# Altium schematic sheet Mainboard_MCU_Breakout.SchDoc
size C
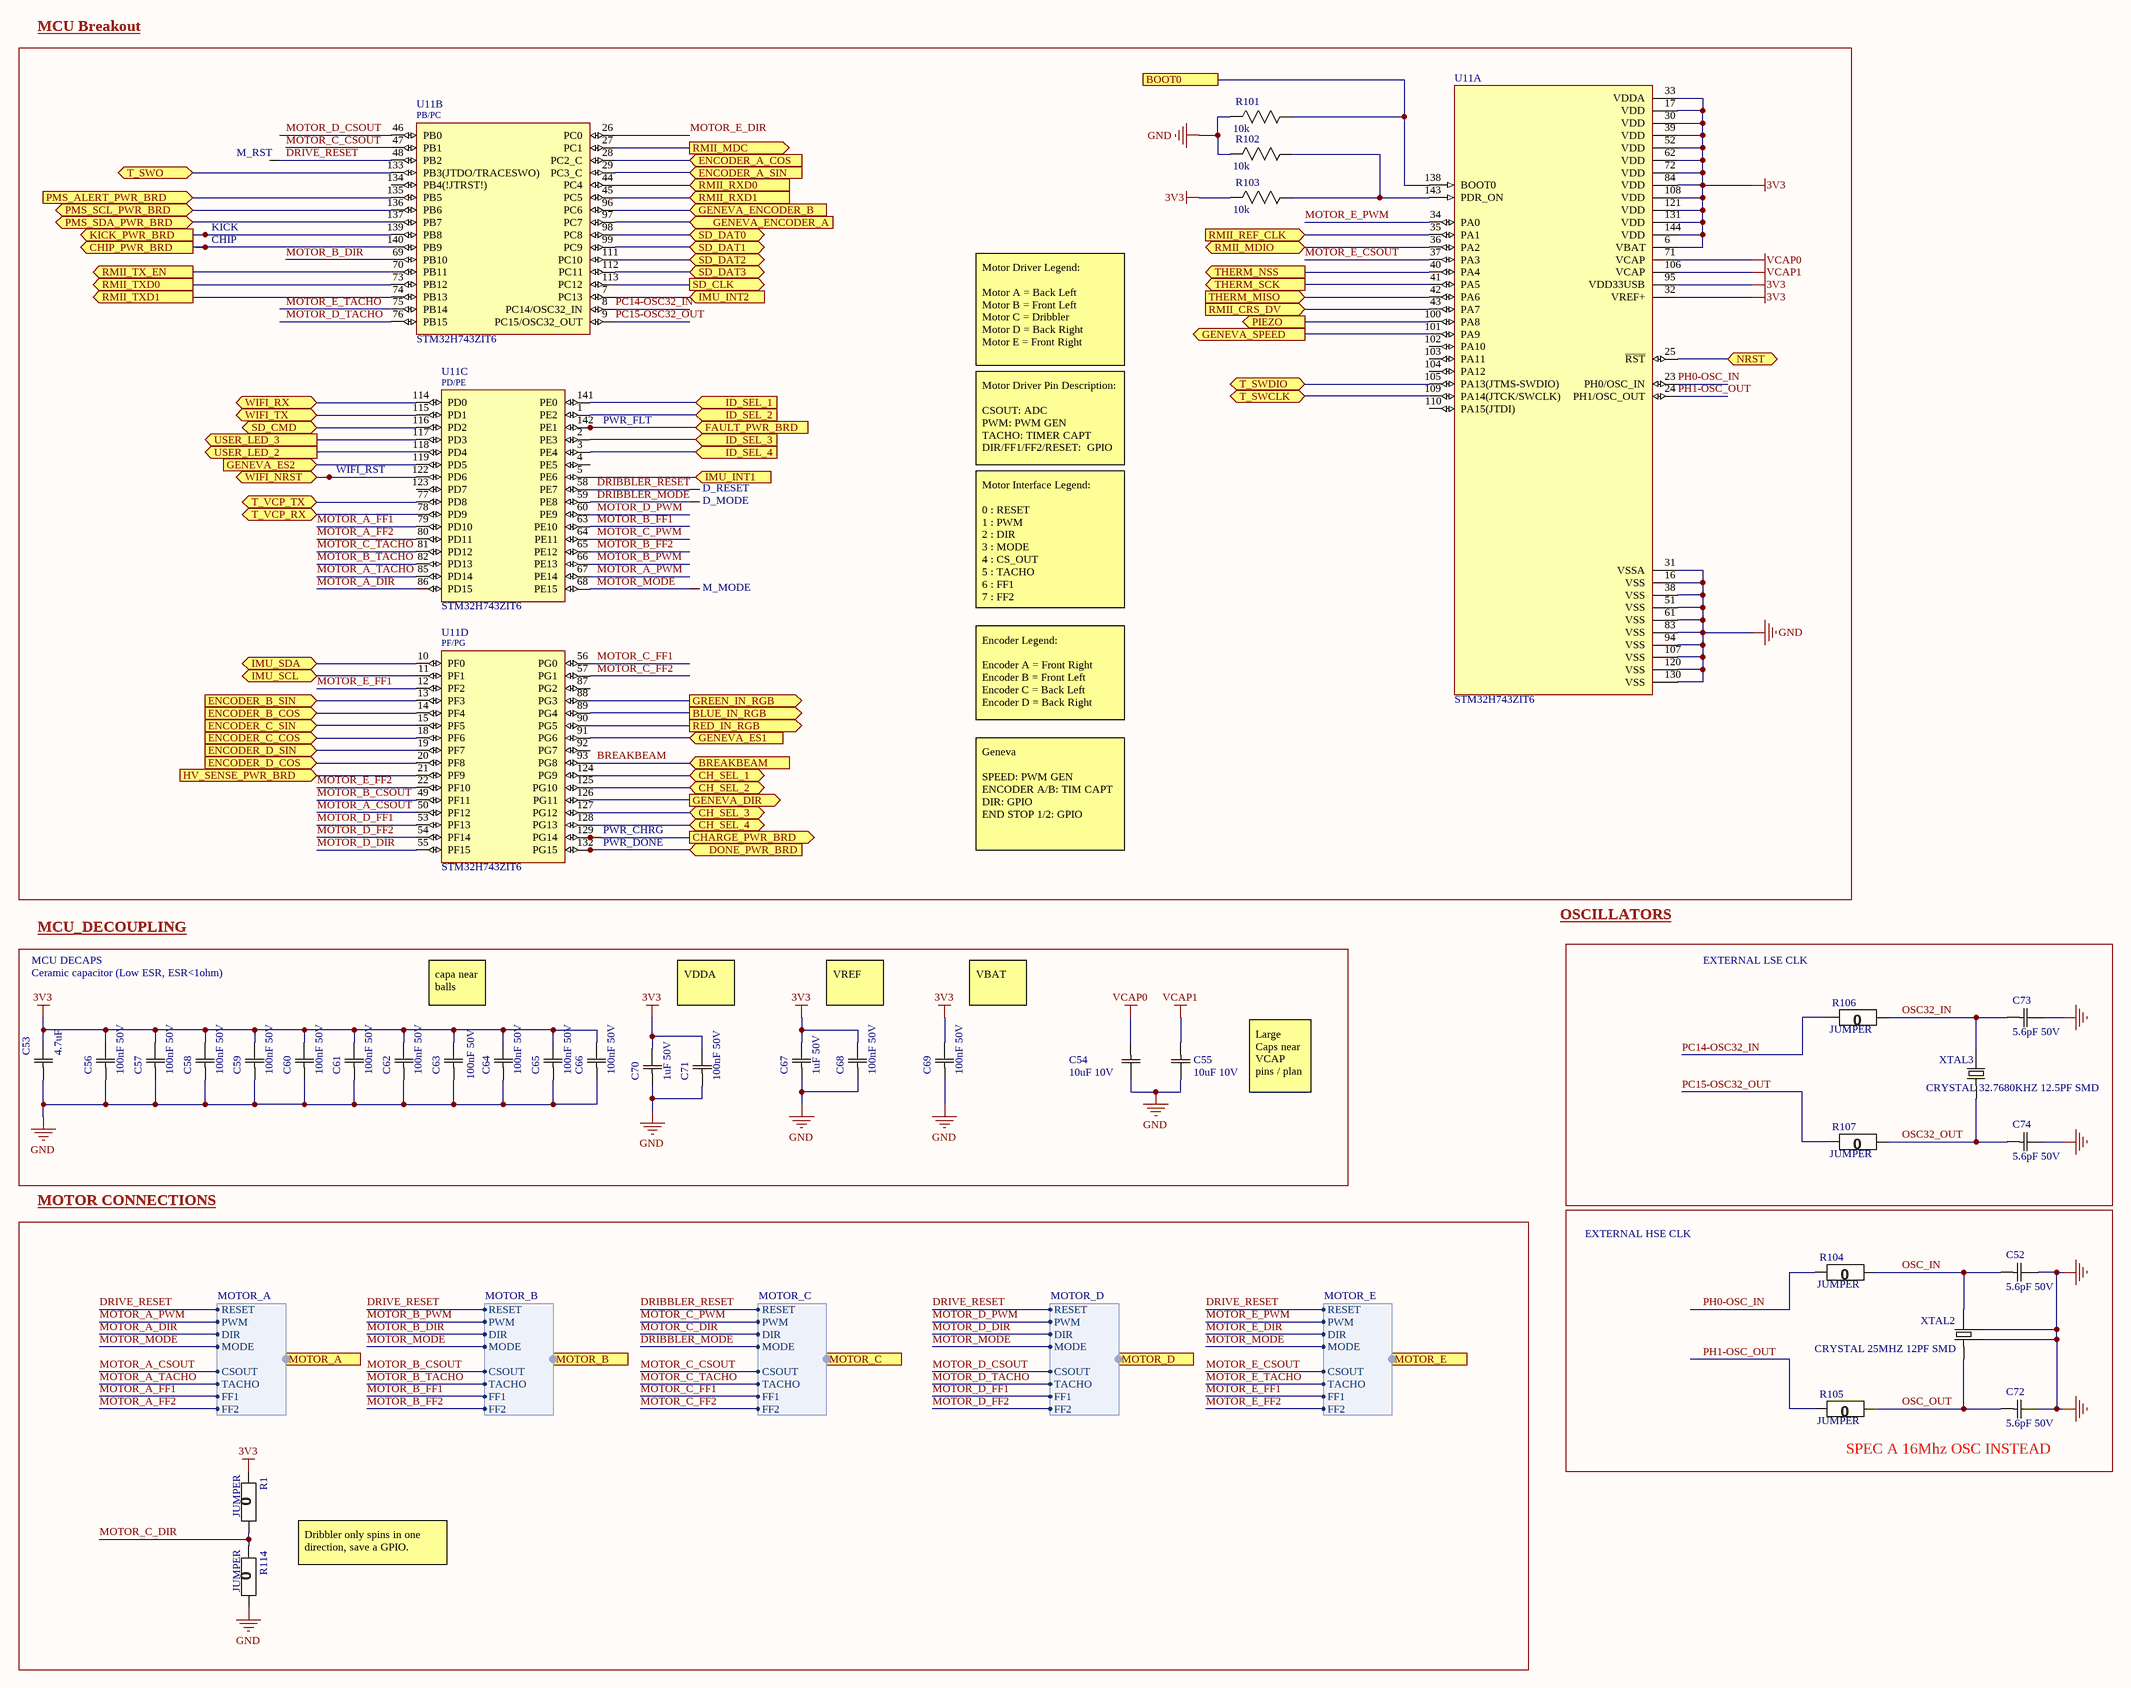
[diagram p0: Mainboard_MCU_Breakout.SchDoc]

## Parts
C52  5.6pF 50V  [0603]
C53  4.7uF  [0603]
C54  10uF 10V  [0603]
C55  10uF 10V  [0603]
C56  100nF 50V  [0603]
C57  100nF 50V  [0603]
C58  100nF 50V  [0603]
C59  100nF 50V  [0603]
C60  100nF 50V  [0603]
C61  100nF 50V  [0603]
C62  100nF 50V  [0603]
C63  100nF 50V  [0603]
C64  100nF 50V  [0603]
C65  100nF 50V  [0603]
C66  100nF 50V  [0603]
C67  1uF 50V  [0603]
C68  100nF 50V  [0603]
C69  100nF 50V  [0603]
C70  1uF 50V  [0603]
C71  100nF 50V  [0603]
C72  5.6pF 50V  [0603]
C73  5.6pF 50V  [0603]
C74  5.6pF 50V  [0603]
CHIP  Test Point (Via)  [TP]  (value not drawn)
D_MODE  Test Point (Via)  [TP]  (value not drawn)
D_RESET  Test Point (Via)  [TP]  (value not drawn)
KICK  Test Point (Via)  [TP]  (value not drawn)
M_MODE  Test Point (Via)  [TP]  (value not drawn)
M_RST  Test Point (Via)  [TP]  (value not drawn)
PWR_CHRG  Test Point (Via)  [TP]  (value not drawn)
PWR_DONE  Test Point (Via)  [TP]  (value not drawn)
PWR_FLT  Test Point (Via)  [TP]  (value not drawn)
R1  JUMPER  [0603]
R101  10k  [0603]
R102  10k  [0603]
R103  10k  [0603]
R104  JUMPER  [0603]
R105  JUMPER  [0603]
R106  JUMPER  [0603]
R107  JUMPER  [0603]
R114  JUMPER  [0603]
U11  STM32H743ZIT6  [QFP50P2200X2200X160-144N]  (parts A,B,C,D of 4)
WIFI_RST  Test Point (Via)  [TP]  (value not drawn)
XTAL2  CRYSTAL 25MHZ 12PF SMD  [3225-4SMD]
XTAL3  CRYSTAL 32.7680KHZ 12.5PF SMD  [3215 SMD2]

## Blocks framed on the sheet
MCU Breakout: CHIP D_MODE D_RESET KICK M_MODE M_RST PWR_CHRG PWR_DONE PWR_FLT R101-R103 U11 WIFI_RST
MCU_DECOUPLING: C53-C71
EXTERNAL LSE CLK: C73 C74 R106 R107 XTAL3
MOTOR CONNECTIONS: R1 R114
SPEC A 16Mhz OSC INSTEAD: C52 C72 R104 R105 XTAL2

## Ports
BLUE_IN_RGB (out), BOOT0, BREAKBEAM (in), CH_SEL_1 (bidir), CH_SEL_2 (bidir), CH_SEL_3 (bidir), CH_SEL_4 (bidir), CHARGE_PWR_BRD (out), CHIP_PWR_BRD (out), DONE_PWR_BRD (in), ENCODER_A_COS (in), ENCODER_A_SIN (in), ENCODER_B_COS (in), ENCODER_B_SIN (in), ENCODER_C_COS (in), ENCODER_C_SIN (in), ENCODER_D_COS (in), ENCODER_D_SIN (in), FAULT_PWR_BRD (in), GENEVA_DIR (out), GENEVA_ENCODER_A (in), GENEVA_ENCODER_B (in), GENEVA_ES1 (in), GENEVA_ES2 (in), GENEVA_SPEED (out), GREEN_IN_RGB (out), HV_SENSE_PWR_BRD (in), ID_SEL_1 (in), ID_SEL_2 (in), ID_SEL_3 (in), ID_SEL_4 (in), IMU_INT1 (in), IMU_INT2 (in), IMU_SCL (bidir), IMU_SDA (bidir), KICK_PWR_BRD (out), MOTOR_A (harness MOTOR_A), MOTOR_B (harness MOTOR_B), MOTOR_C (harness MOTOR_C), MOTOR_D (harness MOTOR_D), MOTOR_E (harness MOTOR_E), NRST (bidir), PIEZO (out), PMS_ALERT_PWR_BRD (in), PMS_SCL_PWR_BRD (bidir), PMS_SDA_PWR_BRD (bidir), RED_IN_RGB (out), RMII_CRS_DV (in), RMII_MDC (out), RMII_MDIO (bidir), RMII_REF_CLK (in), RMII_RXD0 (in), RMII_RXD1 (in), RMII_TX_EN (out), RMII_TXD0 (out), RMII_TXD1 (out), SD_CLK (out), SD_CMD (bidir), SD_DAT0 (bidir), SD_DAT1 (bidir), SD_DAT2 (bidir), SD_DAT3 (bidir), T_SWCLK (bidir), T_SWDIO (bidir), T_SWO (bidir), T_VCP_RX (bidir), T_VCP_TX (bidir), THERM_MISO (in), THERM_NSS (out), THERM_SCK (out), USER_LED_2 (out), USER_LED_3 (out), WIFI_NRST (bidir), WIFI_RX (bidir), WIFI_TX (bidir)

## Harnesses
MOTOR_E: DIR, MODE, TACHO, FF1, FF2, PWM, RESET, CSOUT
MOTOR_A: DIR, MODE, TACHO, FF1, FF2, PWM, RESET, CSOUT
MOTOR_B: DIR, MODE, TACHO, FF1, FF2, PWM, RESET, CSOUT
MOTOR_C: DIR, MODE, TACHO, FF1, FF2, PWM, RESET, CSOUT
MOTOR_D: DIR, MODE, TACHO, FF1, FF2, PWM, RESET, CSOUT

## Nets
3V3: C53.2(C2) C56.2(C2) C57.2(C2) C58.2(C2) C59.2(C2) C60.2(C2) C61.2(C2) C62.2(C2) C63.2(C2) C64.2(C2) C65.2(C2) C66.2(C2) C67.2(C2) C68.2(C2) C69.2(C2) C70.2(C2) C71.2(C2) R1.2(R2) R103.2(R2) U11.6(VBAT) U11.17(VDD) U11.30(VDD) U11.32(VREF+) U11.33(VDDA) U11.39(VDD) U11.52(VDD) U11.62(VDD) U11.72(VDD) U11.84(VDD) U11.95(VDD33USB) U11.108(VDD) U11.121(VDD) U11.131(VDD) U11.144(VDD)
GND: C52.2(C2) C53.1(C1) C54.2(C2) C55.2(C2) C56.1(C1) C57.1(C1) C58.1(C1) C59.1(C1) C60.1(C1) C61.1(C1) C62.1(C1) C63.1(C1) C64.1(C1) C65.1(C1) C66.1(C1) C67.1(C1) C68.1(C1) C69.1(C1) C70.1(C1) C71.1(C1) C72.2(C2) C73.2(C2) C74.2(C2) R101.2(R2) R102.2(R2) R114.1(R1) U11.16(VSS) U11.31(VSSA) U11.38(VSS) U11.51(VSS) U11.61(VSS) U11.83(VSS) U11.94(VSS) U11.107(VSS) U11.120(VSS) U11.130(VSS) XTAL2.2 XTAL2.4
VCAP0: C54.1(C1) U11.71(VCAP)
VCAP1: C55.1(C1) U11.106(VCAP)
BLUE_IN_RGB: U11.89(PG4) ; port BLUE_IN_RGB
BOOT0: R101.1(R1) U11.138(BOOT0) ; port BOOT0
BREAKBEAM: U11.93(PG8) ; port BREAKBEAM
CH_SEL_1: U11.124(PG9) ; port CH_SEL_1
CH_SEL_2: U11.125(PG10) ; port CH_SEL_2
CH_SEL_3: U11.127(PG12) ; port CH_SEL_3
CH_SEL_4: U11.128(PG13) ; port CH_SEL_4
CHARGE_PWR_BRD: PWR_CHRG.1 U11.129(PG14) ; port CHARGE_PWR_BRD
CHIP_PWR_BRD: CHIP.1 U11.140(PB9) ; port CHIP_PWR_BRD
DONE_PWR_BRD: PWR_DONE.1 U11.132(PG15) ; port DONE_PWR_BRD
DRIBBLER_MODE: D_MODE.1 U11.59(PE8) ; port MOTOR_C.MODE
DRIBBLER_RESET: D_RESET.1 U11.58(PE7) ; port MOTOR_C.RESET
DRIVE_RESET: M_RST.1 U11.48(PB2) ; port MOTOR_E.RESET, port MOTOR_A.RESET, port MOTOR_B.RESET, port MOTOR_D.RESET
ENCODER_A_COS: U11.28(PC2_C) ; port ENCODER_A_COS
ENCODER_A_SIN: U11.29(PC3_C) ; port ENCODER_A_SIN
ENCODER_B_COS: U11.14(PF4) ; port ENCODER_B_COS
ENCODER_B_SIN: U11.13(PF3) ; port ENCODER_B_SIN
ENCODER_C_COS: U11.18(PF6) ; port ENCODER_C_COS
ENCODER_C_SIN: U11.15(PF5) ; port ENCODER_C_SIN
ENCODER_D_COS: U11.20(PF8) ; port ENCODER_D_COS
ENCODER_D_SIN: U11.19(PF7) ; port ENCODER_D_SIN
FAULT_PWR_BRD: PWR_FLT.1 U11.142(PE1) ; port FAULT_PWR_BRD
GENEVA_DIR: U11.126(PG11) ; port GENEVA_DIR
GENEVA_ENCODER_A: U11.97(PC7) ; port GENEVA_ENCODER_A
GENEVA_ENCODER_B: U11.96(PC6) ; port GENEVA_ENCODER_B
GENEVA_ES1: U11.91(PG6) ; port GENEVA_ES1
GENEVA_ES2: U11.119(PD5) ; port GENEVA_ES2
GENEVA_SPEED: U11.101(PA9) ; port GENEVA_SPEED
GREEN_IN_RGB: U11.88(PG3) ; port GREEN_IN_RGB
HV_SENSE_PWR_BRD: U11.21(PF9) ; port HV_SENSE_PWR_BRD
ID_SEL_1: U11.141(PE0) ; port ID_SEL_1
ID_SEL_2: U11.1(PE2) ; port ID_SEL_2
ID_SEL_3: U11.2(PE3) ; port ID_SEL_3
ID_SEL_4: U11.3(PE4) ; port ID_SEL_4
IMU_INT1: U11.5(PE6) ; port IMU_INT1
IMU_INT2: U11.7(PC13) ; port IMU_INT2
IMU_SCL: U11.11(PF1) ; port IMU_SCL
IMU_SDA: U11.10(PF0) ; port IMU_SDA
KICK_PWR_BRD: KICK.1 U11.139(PB8) ; port KICK_PWR_BRD
MOTOR_A_CSOUT: U11.50(PF12) ; port MOTOR_A.CSOUT
MOTOR_A_DIR: U11.86(PD15) ; port MOTOR_A.DIR
MOTOR_A_FF1: U11.79(PD10) ; port MOTOR_A.FF1
MOTOR_A_FF2: U11.80(PD11) ; port MOTOR_A.FF2
MOTOR_A_PWM: U11.67(PE14) ; port MOTOR_A.PWM
MOTOR_A_TACHO: U11.85(PD14) ; port MOTOR_A.TACHO
MOTOR_B_CSOUT: U11.49(PF11) ; port MOTOR_B.CSOUT
MOTOR_B_DIR: U11.69(PB10) ; port MOTOR_B.DIR
MOTOR_B_FF1: U11.63(PE10) ; port MOTOR_B.FF1
MOTOR_B_FF2: U11.65(PE12) ; port MOTOR_B.FF2
MOTOR_B_PWM: U11.66(PE13) ; port MOTOR_B.PWM
MOTOR_B_TACHO: U11.82(PD13) ; port MOTOR_B.TACHO
MOTOR_C_CSOUT: U11.47(PB1) ; port MOTOR_C.CSOUT
MOTOR_C_DIR: R1.1(R1) R114.2(R2) ; port MOTOR_C.DIR
MOTOR_C_FF1: U11.56(PG0) ; port MOTOR_C.FF1
MOTOR_C_FF2: U11.57(PG1) ; port MOTOR_C.FF2
MOTOR_C_PWM: U11.64(PE11) ; port MOTOR_C.PWM
MOTOR_C_TACHO: U11.81(PD12) ; port MOTOR_C.TACHO
MOTOR_D_CSOUT: U11.46(PB0) ; port MOTOR_D.CSOUT
MOTOR_D_DIR: U11.55(PF15) ; port MOTOR_D.DIR
MOTOR_D_FF1: U11.53(PF13) ; port MOTOR_D.FF1
MOTOR_D_FF2: U11.54(PF14) ; port MOTOR_D.FF2
MOTOR_D_PWM: U11.60(PE9) ; port MOTOR_D.PWM
MOTOR_D_TACHO: U11.76(PB15) ; port MOTOR_D.TACHO
MOTOR_E_CSOUT: U11.37(PA3) ; port MOTOR_E.CSOUT
MOTOR_E_DIR: U11.26(PC0) ; port MOTOR_E.DIR
MOTOR_E_FF1: U11.12(PF2) ; port MOTOR_E.FF1
MOTOR_E_FF2: U11.22(PF10) ; port MOTOR_E.FF2
MOTOR_E_PWM: U11.34(PA0) ; port MOTOR_E.PWM
MOTOR_E_TACHO: U11.75(PB14) ; port MOTOR_E.TACHO
MOTOR_MODE: M_MODE.1 U11.68(PE15) ; port MOTOR_E.MODE, port MOTOR_A.MODE, port MOTOR_B.MODE, port MOTOR_D.MODE
NRST: U11.25(~{RST}) ; port NRST
OSC32_IN: C73.1(C1) R106.1(R1) XTAL3.2
OSC32_OUT: C74.1(C1) R107.1(R1) XTAL3.1
OSC_IN: C52.1(C1) R104.1(R1) XTAL2.3
OSC_OUT: C72.1(C1) R105.1(R1) XTAL2.1
PC14-OSC32_IN: R106.2(R2) U11.8(PC14/OSC32_IN)
PC15-OSC32_OUT: R107.2(R2) U11.9(PC15/OSC32_OUT)
PH0-OSC_IN: R104.2(R2) U11.23(PH0/OSC_IN)
PH1-OSC_OUT: R105.2(R2) U11.24(PH1/OSC_OUT)
PIEZO: U11.100(PA8) ; port PIEZO
PMS_ALERT_PWR_BRD: U11.135(PB5) ; port PMS_ALERT_PWR_BRD
PMS_SCL_PWR_BRD: U11.136(PB6) ; port PMS_SCL_PWR_BRD
PMS_SDA_PWR_BRD: U11.137(PB7) ; port PMS_SDA_PWR_BRD
RED_IN_RGB: U11.90(PG5) ; port RED_IN_RGB
RMII_CRS_DV: U11.43(PA7) ; port RMII_CRS_DV
RMII_MDC: U11.27(PC1) ; port RMII_MDC
RMII_MDIO: U11.36(PA2) ; port RMII_MDIO
RMII_REF_CLK: U11.35(PA1) ; port RMII_REF_CLK
RMII_RXD0: U11.44(PC4) ; port RMII_RXD0
RMII_RXD1: U11.45(PC5) ; port RMII_RXD1
RMII_TX_EN: U11.70(PB11) ; port RMII_TX_EN
RMII_TXD0: U11.73(PB12) ; port RMII_TXD0
RMII_TXD1: U11.74(PB13) ; port RMII_TXD1
SD_CLK: U11.113(PC12) ; port SD_CLK
SD_CMD: U11.116(PD2) ; port SD_CMD
SD_DAT0: U11.98(PC8) ; port SD_DAT0
SD_DAT1: U11.99(PC9) ; port SD_DAT1
SD_DAT2: U11.111(PC10) ; port SD_DAT2
SD_DAT3: U11.112(PC11) ; port SD_DAT3
T_SWCLK: U11.109(PA14(JTCK/SWCLK)) ; port T_SWCLK
T_SWDIO: U11.105(PA13(JTMS-SWDIO)) ; port T_SWDIO
T_SWO: U11.133(PB3(JTDO/TRACESWO)) ; port T_SWO
T_VCP_RX: U11.78(PD9) ; port T_VCP_RX
T_VCP_TX: U11.77(PD8) ; port T_VCP_TX
THERM_MISO: U11.42(PA6) ; port THERM_MISO
THERM_NSS: U11.40(PA4) ; port THERM_NSS
THERM_SCK: U11.41(PA5) ; port THERM_SCK
USER_LED_2: U11.118(PD4) ; port USER_LED_2
USER_LED_3: U11.117(PD3) ; port USER_LED_3
WIFI_NRST: U11.122(PD6) WIFI_RST.1 ; port WIFI_NRST
WIFI_RX: U11.114(PD0) ; port WIFI_RX
WIFI_TX: U11.115(PD1) ; port WIFI_TX
NetR102_1: R102.1(R1) R103.1(R1) U11.143(PDR_ON)

Not connected (* = marked no-connect by the designer): U11 4(PE5) 87(PG2) 92(PG7) 102(PA10) 103(PA11) 104(PA12) 110(PA15(JTDI)) 123(PD7) 134(PB4(!JTRST!))

## Notes on the sheet
- Motor Driver Legend:
  Motor A = Back Left
  Motor B = Front Left
  Motor C = Dribbler
  Motor D = Back Right
  Motor E = Front Right
- Motor Driver Pin Description:
  CSOUT: ADC
  PWM: PWM GEN
  TACHO: TIMER CAPT
  DIR/FF1/FF2/RESET:  GPIO
- Motor Interface Legend:
  0 : RESET
  1 : PWM
  2 : DIR
  3 : MODE
  4 : CS_OUT
  5 : TACHO
  6 : FF1
  7 : FF2
- Encoder Legend:
  Encoder A = Front Right
  Encoder B = Front Left
  Encoder C = Back Left
  Encoder D = Back Right
- Geneva
  SPEED: PWM GEN
  ENCODER A/B: TIM CAPT
  DIR: GPIO
  END STOP 1/2: GPIO
- MCU DECAPS
- Ceramic capacitor (Low ESR, ESR<1ohm)
- OSCILLATORS
- capa near balls
- VDDA
- VREF
- VBAT
- Large Caps near VCAP pins / plan
- EXTERNAL HSE CLK
- Dribbler only spins in one direction, save a GPIO.
- (in symbol STM32H743ZIT6, part B) PB/PC
- (in symbol STM32H743ZIT6, part C) PD/PE
- (in symbol STM32H743ZIT6, part D) PF/PG

## Library data of the parts
C52 C72-C74 = CAP 5.6pF 50V: CAP CER 5.6PF 50V C0G/NP0 0805; Tolerance: 5%; Package: 0805; Value: 5.6pF; Rating: 50V; Temperature Coefficient: C0G/NP0; Operating Temperature: -55°C ~ 125°C
C53 = CAP 4.7uF 35V: CAP CER 4.7UF 35V X7R 0603/0805; Tolerance: 10%; Package: 0603/0805; Value: 4.7uF; Rating: 35V; Temperature Coefficient: X7R; Operating Temperature: -55°C ~ 125°C
C54 C55 = CAP 10uF 10V: CAP CER 10UF 10V X5R 0805; Tolerance: 10%; Package: 0805; Value: 10uF; Rating: 10V
C56-C66 C68 C69 C71 = CAP 100nF 50V: CAP CER 0.1UF 50V X7R 0805; Tolerance: 10%; Package: 0805; Value: 100nF; Rating: 50V
C67 C70 = CAP 1uF 50V: CAP CER 1UF 50V X7R 0805; Tolerance: 10%; Package: 0805; Value: 1uF; Rating: 50V; Temperature Coefficient: X7R; Operating Temperature: -55°C ~ 125°C
R1 R104-R107 R114 = RES 0 JUMPER: RES SMD 0 OHM JUMPER GENERIC 0805; Value: 0; Package: 0805
R101-R103 = RES 10k 1/8W - 1%: RES SMD 10K OHM 1% 1/8W 0805; Power (Watts): 0.125W; Package: 0805; Value: 10k; Tolerance: 1%
U11 = STM32H743ZIT6: ARM® Cortex®-M7 STM32H7 Microcontroller IC 32-Bit 480MHz 2MB (2M x 8) FLASH 144-LQFP (20x20); MF: STMicroelectronics; Package: LQFP-144 STMicroelectronics; MP: STM32H743ZIT6; ComponentLink1Description: SnapEDA; ComponentLink1URL: https://www.snapeda.com/parts/STM32H743ZIT6/STMicroelectronics/view-part/1041111/?ref=snap; ComponentLink2Description: DigiKey; ComponentLink2URL: https://www.digikey.ca/en/products/detail/stmicroelectronics/STM32H743ZIT6/7809238; ComponentLink3Description: Datasheet; ComponentLink3URL: https://www.st.com/resource/en/datasheet/stm32h743bi.pdf; Digikey: 497-17721-ND
XTAL2 = XTAL 25MHZ 12PF SMD4: 25MHz ±10ppm Crystal 12pF 40 Ohms 2-SMD, No Lead; MP: X322525MOB4SI; MF: Yangxing Tech; ESR: 70 Ohms; Package: 2-SMD, No Lead; Frequency: 25MHz; Load Capacitance: 12pF; Supplier 1: Digi-Key
XTAL3 = XTAL 32.7680KHZ 12.5PF SMD 3215: 32.768kHz ±20ppm Crystal 12.5pF 70 kOhms 3215SMD, No Lead; MP: Q13FC1350000400; MF: Seiko Epson; Package: 2-SMD, No Lead; Frequency: 32.768kHz; Load Capacitance: 12.5pF; ESR: 70 kOhms; ComponentLink1Description: Digikey; ComponentLink1URL: https://www.digikey.ca/en/products/detail/ndk-america-inc/NX3215SA-32-768K-STD-MUA-8/2261469; ComponentLink2Description: Datasheet; ComponentLink2URL: https://media.digikey.com/datasheets/production/702868/1/NX3215SA-32-768K-STD-MUA-8.html; Supplier 1: RSComponents; Supplier Part Number 1: 1712309